# Altium schematic sheet MCU.SchDoc
size A
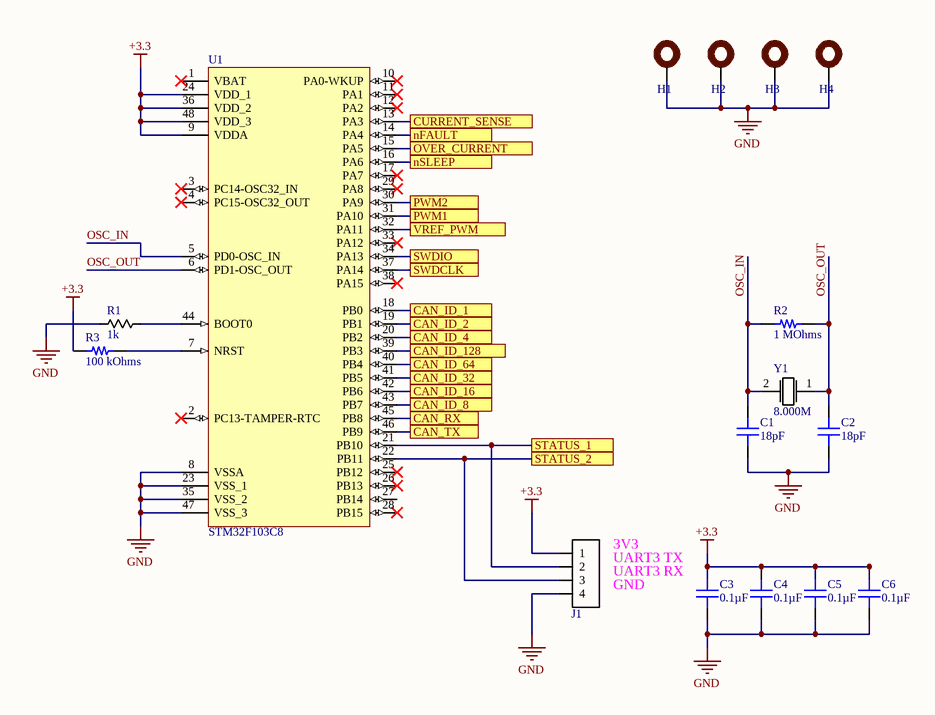
[diagram p0: MCU.SchDoc]

## Parts
C1  18pF  [CAP 0603_1608]
C2  18pF  [CAP 0603_1608]
C3  0.1µF  [CAP 0805_2012]
C4  0.1µF  [CAP 0805_2012]
C5  0.1µF  [CAP 0805_2012]
C6  0.1µF  [CAP 0805_2012]
H1  mounting_hole_0  [#8-32_SOCKET_HEAD]  (value not drawn)
H2  mounting_hole_0  [#8-32_SOCKET_HEAD]  (value not drawn)
H3  mounting_hole_0  [#8-32_SOCKET_HEAD]  (value not drawn)
H4  mounting_hole_0  [#8-32_SOCKET_HEAD]  (value not drawn)
J1  conn-4x1_0  [HDDR_4x1_0]  (value not drawn)
R1  1k  [chip_0805]
R2  1 MOhms  [RES 0603_1608]
R3  100 kOhms  [RES 0603_1608]
U1  STM32F103C8  [LQFP48_0]
Y1  Frequency: 8.000M  [ABLS_AT49_OSC]  (hidden comment: osc_xtal_2p_0)

## Ports
CAN_ID_1, CAN_ID_2, CAN_ID_4, CAN_ID_8, CAN_ID_16, CAN_ID_32, CAN_ID_64, CAN_ID_128, CAN_RX, CAN_TX, CURRENT_SENSE, nFAULT, nSLEEP, OVER_CURRENT, PWM1, PWM2, STATUS_1, STATUS_2, SWDCLK, SWDIO, VREF_PWM

## Nets
+3.3: C3.2 C4.2 C5.2 C6.2 J1.1 R3.1 U1.9(VDDA) U1.24(VDD_1) U1.36(VDD_2) U1.48(VDD_3)
GND: C1.1 C2.1 C3.1 C4.1 C5.1 C6.1 H1.0(A) H2.0(A) H3.0(A) H4.0(A) J1.4 R1.1 U1.8(VSSA) U1.23(VSS_1) U1.35(VSS_2) U1.47(VSS_3)
CAN_ID_1: U1.18(PB0) ; port CAN_ID_1
CAN_ID_2: U1.19(PB1) ; port CAN_ID_2
CAN_ID_4: U1.20(PB2) ; port CAN_ID_4
CAN_ID_8: U1.43(PB7) ; port CAN_ID_8
CAN_ID_16: U1.42(PB6) ; port CAN_ID_16
CAN_ID_32: U1.41(PB5) ; port CAN_ID_32
CAN_ID_64: U1.40(PB4) ; port CAN_ID_64
CAN_ID_128: U1.39(PB3) ; port CAN_ID_128
CAN_RX: U1.45(PB8) ; port CAN_RX
CAN_TX: U1.46(PB9) ; port CAN_TX
CURRENT_SENSE: U1.13(PA3) ; port CURRENT_SENSE
nFAULT: U1.14(PA4) ; port nFAULT
nSLEEP: U1.16(PA6) ; port nSLEEP
OSC_IN: C1.2 R2.1 U1.5(PD0-OSC_IN) Y1.2
OSC_OUT: C2.2 R2.2 U1.6(PD1-OSC_OUT) Y1.1
OVER_CURRENT: U1.15(PA5) ; port OVER_CURRENT
PWM1: U1.31(PA10) ; port PWM1
PWM2: U1.30(PA9) ; port PWM2
STATUS_1: J1.2 U1.21(PB10) ; port STATUS_1
STATUS_2: J1.3 U1.22(PB11) ; port STATUS_2
SWDCLK: U1.37(PA14) ; port SWDCLK
SWDIO: U1.34(PA13) ; port SWDIO
VREF_PWM: U1.32(PA11) ; port VREF_PWM
NetR1_2: R1.2 U1.44(BOOT0)
NetR3_2: R3.2 U1.7(NRST)

Not connected (* = marked no-connect by the designer): U1 1(VBAT)* 2(PC13-TAMPER-RTC)* 3(PC14-OSC32_IN)* 4(PC15-OSC32_OUT)* 10(PA0-WKUP)* 11(PA1)* 12(PA2)* 17(PA7)* 25(PB12)* 26(PB13)* 27(PB14) 28(PB15)* 29(PA8)* 33(PA12)* 38(PA15)*

## Notes on the sheet
- UART3 TX
- UART3 RX
- (near J1) 3V3
- (near J1) GND

## Library data of the parts
C1 C2 = C0603X180J5GACTU: CAP CER 18PF 50V C0G/NP0 0603; Manufacturer: KEMET; Temperature Coefficient: C0G, NP0; Tolerance: ±5%; Part Number: C0603X180J5GACTU; Value: 18pF; Applications: Boardflex Sensitive; Capacitance: 18pF; ComponentLink1Description: Datasheet; ComponentLink1URL: https://api.kemet.com/component-edge/download/specsheet/C0603X180J5GACTU.pdf; ComponentLink2Description: DigiKey Link; ComponentLink2URL: http://digikey.com/product-detail/en/kemet/C0603X180J5GACTU/399-7390-1-ND/3317424; Device Package: 0603 (1608 Metric); Features: Low ESL, Soft Termination; LastUpdated: 9/2/2020 1:03:35 AM; Lifecycle Status: Active; Minimum Order: 1; Mounting Type: Surface Mount, MLCC; Operating Temperature: -55°C ~ 125°C; Package / Case: 0603 (1608 Metric); Packaging: TapeAndReel; PartId: 2471; Part Status: Active; Price: 0.08; Series: SMD Comm C0G Flex; Size / Dimension: 0.063" L x 0.031" W (1.60mm x 0.80mm); Supplier 1: DigiKey; Supplier Part Number 1: 399-7390-1-ND; Thickness (Max): 0.034" (0.87mm); Voltage - Rated: 50V
C3-C6 = C0805X104K5RAC3316: CAP CER 0805 0.1UF 50V X7R; Manufacturer: KEMET; Tolerance: ±10%; Part Number: C0805X104K5RAC3316; Value: 0.1µF; Applications: Automotive, Boardflex Sensitive; Capacitance: 0.1µF; ComponentLink1Description: Datasheet; ComponentLink1URL: https://api.kemet.com/component-edge/download/datasheet/C0805X104K5RAC3316.pdf; ComponentLink2Description: DigiKey Link; ComponentLink2URL: http://digikey.com/product-detail/en/kemet/C0805X104K5RAC3316/399-C0805X104K5RAC3316CT-ND/10315823; Device Package: 0805 (2012 Metric); Features: Soft Termination; LastUpdated: 9/2/2020 1:04:41 AM; Lifecycle Status: Active; Minimum Order: 1; Mounting Type: Surface Mount, MLCC; Operating Temperature: -55°C ~ 125°C; Package / Case: 0805 (2012 Metric); Packaging: TapeAndReel; PartId: 2769; Part Status: Active; Price: 0.08; Ratings: AEC-Q200; Series: SMD Auto X7R VW80808; Size / Dimension: 0.079" L x 0.049" W (2.00mm x 1.25mm); Supplier 1: DigiKey; Supplier Part Number 1: 399-C0805X104K5RAC3316CT-ND; Temperature Coefficient: X7R; Thickness (Max): 0.047" (1.20mm); Voltage - Rated: 50V
H1-H4 = MISC-00027: #8-32 Mounting Hole for Socket Head Cap Screw; Part Number: MISC-00027
J1 = CONN-00029: Header 4x1, 0.1"; Positions per level: 4; Levels: 1; Part Number: CONN-00029; Type: Header
R1 = RES-00361: RES SMD 1K OHM 1% 1/8W 0805; Manufacturer: Rohm Semiconductor; Manufacturer PN: KTR10EZPF1001; Power Rating: 0.125W; Part Number: RES-00361; Resistance: 1k; Tolerance: 1%
R2 = RCS06031M00FKEA: RES SMD 1M OHM 1% 1/4W 0603; Manufacturer: Vishay Dale; Power (Watts): 0.25W, 1/4W; Temperature Coefficient: ±100ppm/°C; Part Number: RCS06031M00FKEA; Value: 1 MOhms; ComponentLink1Description: Datasheet; ComponentLink1URL: http://www.vishay.com/docs/20065/rcse3.pdf; ComponentLink2Description: DigiKey Link; ComponentLink2URL: http://digikey.com/product-detail/en/vishay-dale/RCS06031M00FKEA/541-2803-1-ND/5867096; Composition: Thick Film; Device Package: 0603 (1608 Metric); Features: Automotive AEC-Q200, Pulse Withstanding; Height - Seated (Max): 0.020" (0.50mm); LastUpdated: 9/2/2020 1:09:49 AM; Lifecycle Status: Active; Minimum Order: 1; Number of Terminations: 2; Operating Temperature: -55°C ~ 155°C; Package / Case: 0603 (1608 Metric); Packaging: TapeAndReel; PartId: 21301; Part Status: Active; Price: 0.02; Ratings: AEC-Q200; Resistance: 1 MOhms; Series: RCS e3; Size / Dimension: 0.061" L x 0.033" W (1.55mm x 0.85mm); Supplier 1: DigiKey; Supplier Part Number 1: 541-2803-1-ND; Supplier Device Package: 0603; Tolerance: ±1%
R3 = CRCW0603100KFKEAHP: RES SMD 100K OHM 1% 1/4W 0603; Manufacturer: Vishay Dale; Power (Watts): 0.25W, 1/4W; Temperature Coefficient: ±100ppm/°C; Part Number: CRCW0603100KFKEAHP; Value: 100 kOhms; ComponentLink1Description: Datasheet; ComponentLink1URL: http://www.vishay.com/docs/20043/crcwhpe3.pdf; ComponentLink2Description: DigiKey Link; ComponentLink2URL: http://digikey.com/product-detail/en/vishay-dale/CRCW0603100KFKEAHP/541-100KSCT-ND/2222790; Composition: Thick Film; Device Package: 0603 (1608 Metric); Features: Automotive AEC-Q200, Pulse Withstanding; Height - Seated (Max): 0.022" (0.55mm); LastUpdated: 9/2/2020 1:10:04 AM; Lifecycle Status: Active; Minimum Order: 1; Number of Terminations: 2; Operating Temperature: -55°C ~ 155°C; Package / Case: 0603 (1608 Metric); Packaging: TapeAndReel; PartId: 14743; Part Status: Active; Price: 0.02; Ratings: AEC-Q200; Resistance: 100 kOhms; Series: CRCW-HP; Size / Dimension: 0.063" L x 0.033" W (1.60mm x 0.85mm); Supplier 1: DigiKey; Supplier Part Number 1: 541-100KSCT-ND; Supplier Device Package: 0603; Tolerance: ±1%
U1 = UCTRL-00008: STM32 M3, LQFP-48; Manufacturer: ST; Manufacturer PN: STM32F103C8; Part Number: UCTRL-00008
Y1 = OSC-00002: XTAL, 8MHz, 18pF, 20ppm; Manufacturer: Abracon; Manufacturer PN: ABLS-8.000MHZ-B2-T; ESR: 80; Stability: 50ppm; Load Capacitance: 18pF; Tolerance: 20ppm; Part Number: OSC-00002